# EAGLE design Metal Detector (EAGLE 9.6.2)
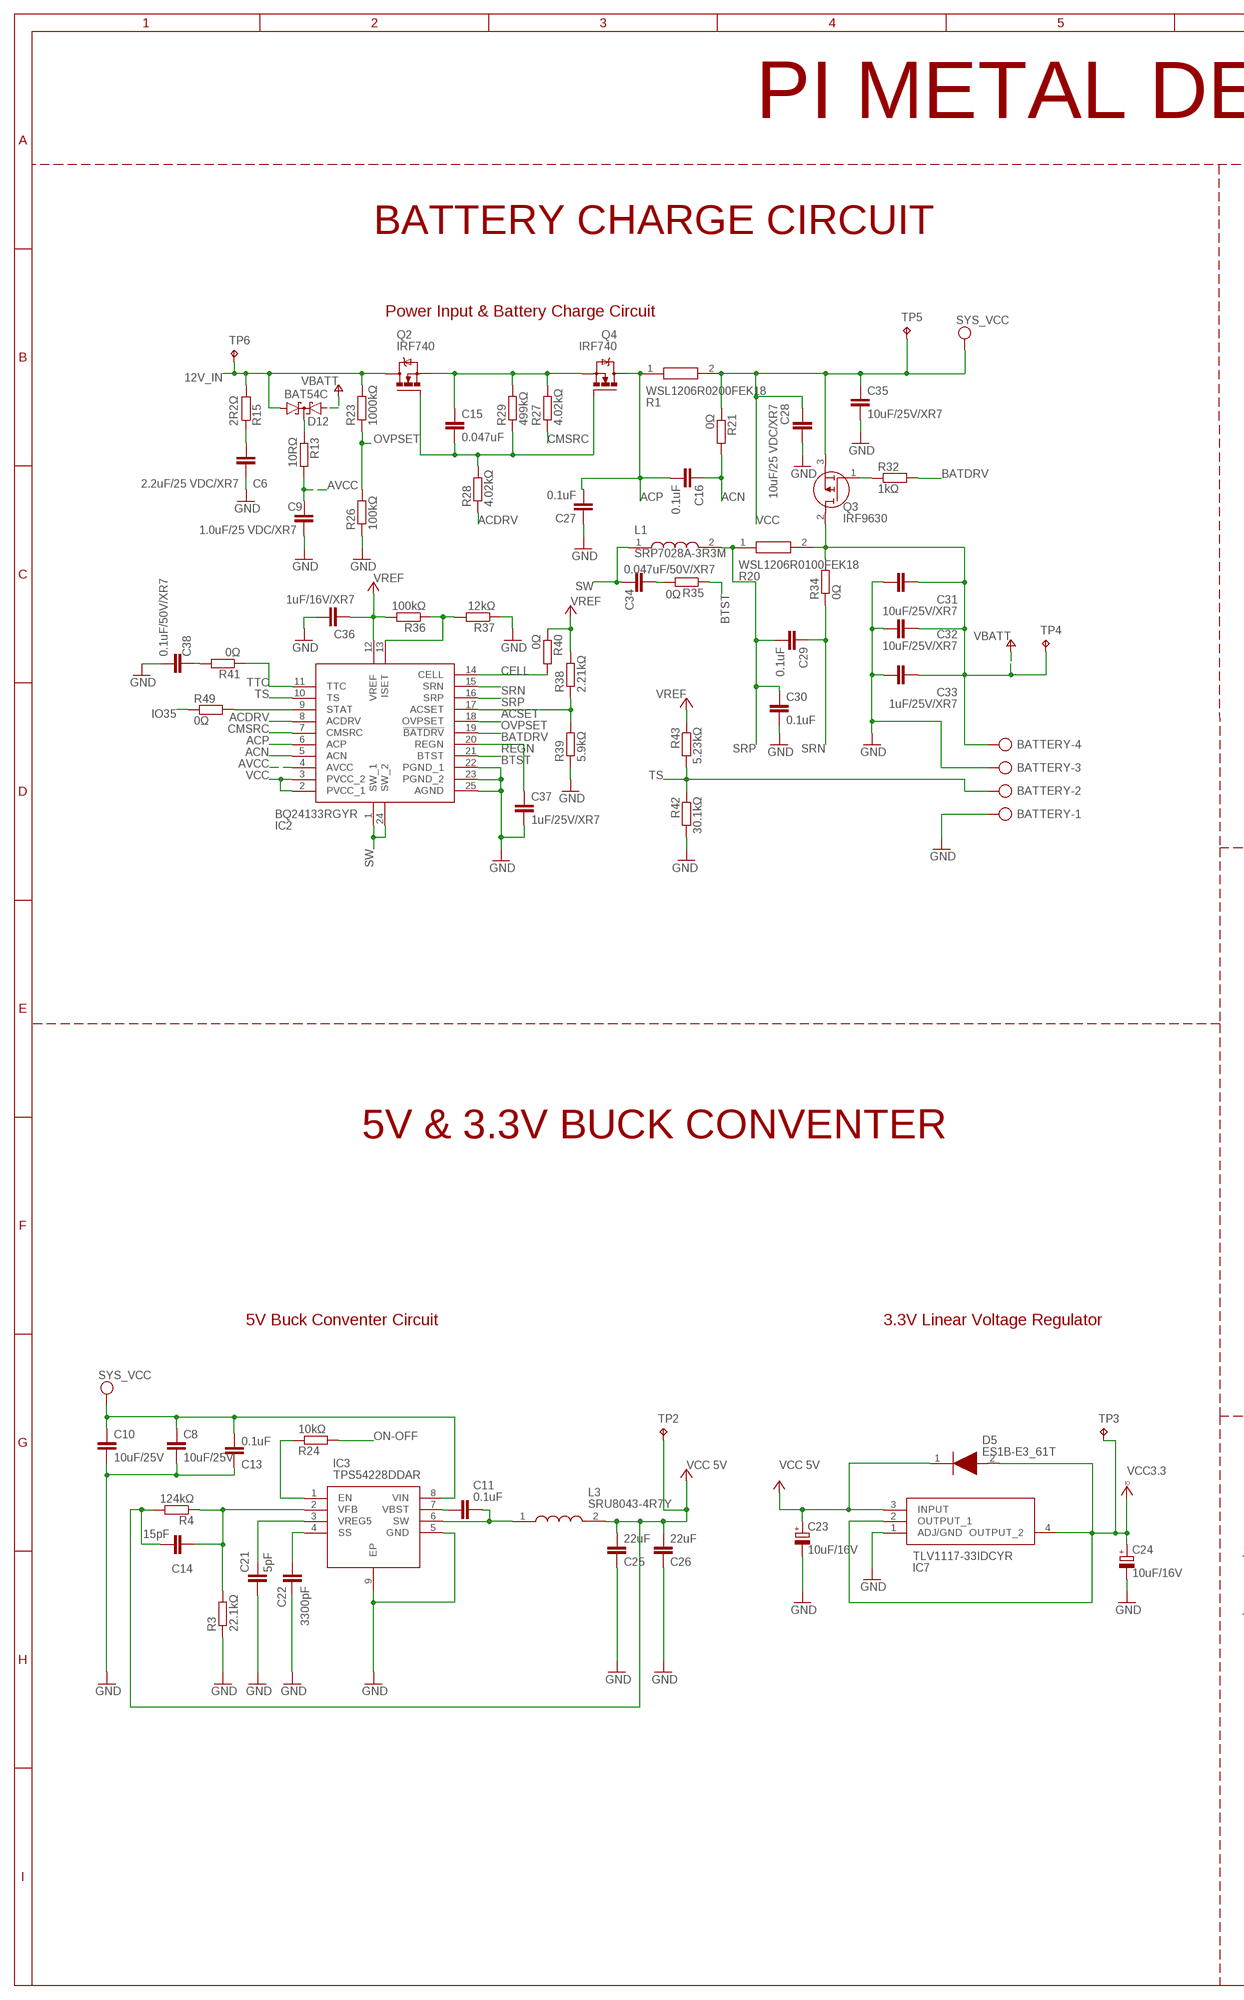
[diagram p0: schematic, sheet 1, part 1 of 2]
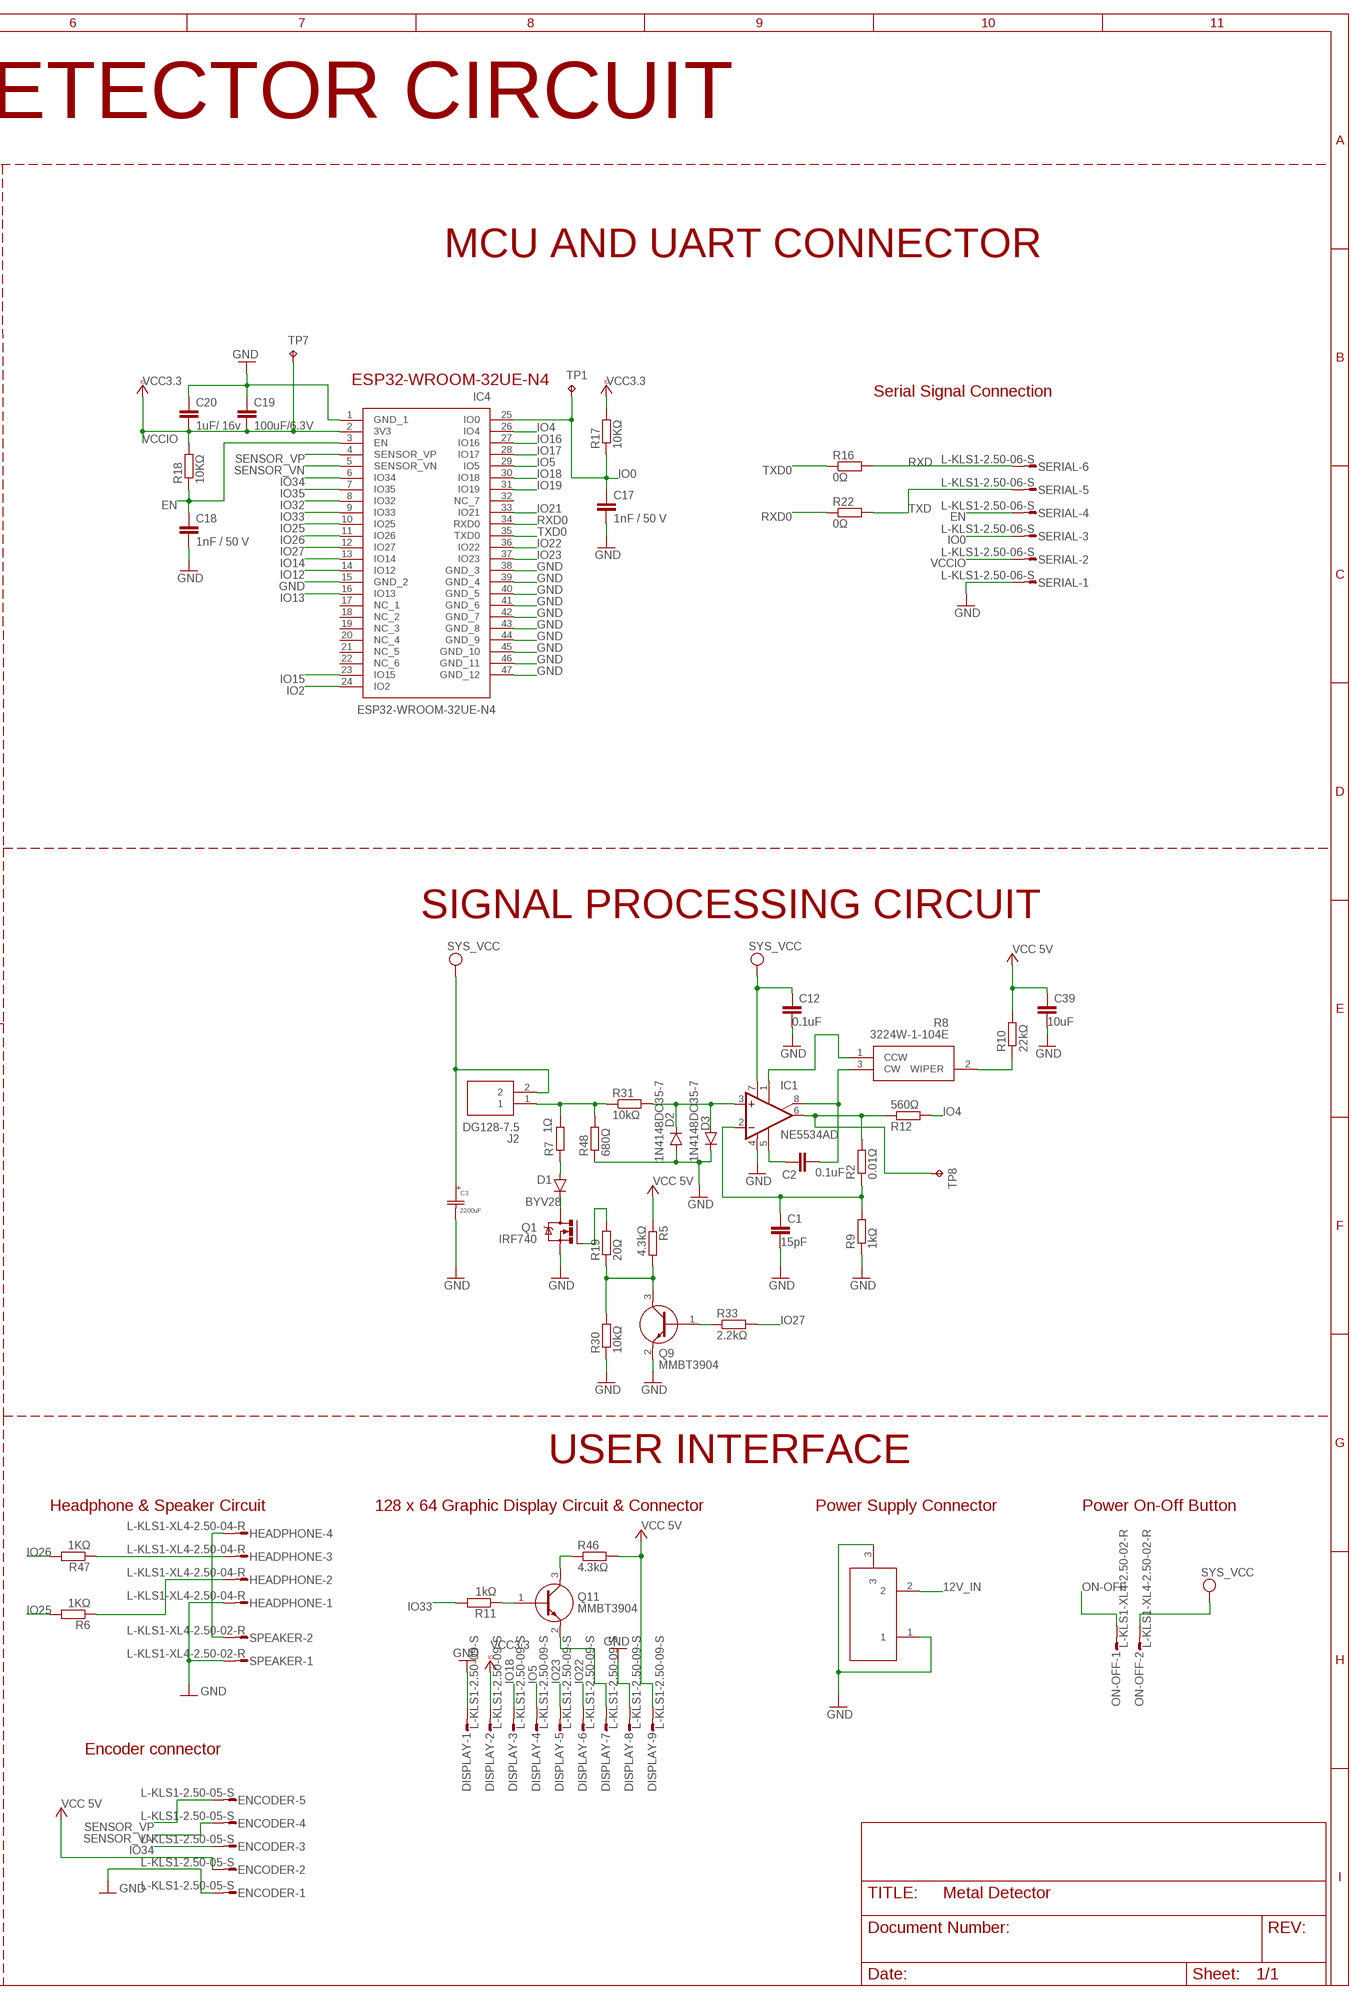
[diagram p1: schematic, sheet 1, part 2 of 2]

## Parts
12VIN  DC21MMX  [DC-21MM]
BATTERY  AK500/4  [AK500/4]
C1  15pF  C-EUC0603  [C0603]
C2  0.1uF  C-EUC0603  [C0603]
C3  2200uF  EEUFR1C222  [CAP_12.5_X_20_PAN]
C6  2.2uF/25 VDC/XR7  1.0UF-1206-50V-10%  [1206]
C8  10uF/25V  C-EUC1210  [C1210]
C9  1.0uF/25 VDC/XR7  1.0UF-1206-50V-10%  [1206]
C10  10uF/25V  C-EUC1210  [C1210]
C11  0.1uF  C-EUC0603  [C0603]
C12  0.1uF  C-EUC0603  [C0603]
C13  0.1uF  C-EUC0603  [C0603]
C14  15pF  C-EUC0603  [C0603]
C15  0.047uF  C-EUC0603  [C0603]
C16  0.1uF  C-EUC0603  [C0603]
C17  1nF / 50 V  C-EUC0603  [C0603]
C18  1nF / 50 V  C-EUC0603  [C0603]
C19  100uF/6.3V  C-EUC1206  [C1206]
C20  1uF/ 16v  C-EUC0603  [C0603]
C21  5pF  C-EUC0603  [C0603]
C22  3300pF  C-EUC0603  [C0603]
C23  10uF/16V  CPOL-EUB  [PANASONIC_B]
C24  10uF/16V  CPOL-EUB  [PANASONIC_B]
C25  22uF  1.0UF-1206-50V-10%  [1206]
C26  22uF  1.0UF-1206-50V-10%  [1206]
C27  0.1uF  C-EUC0603  [C0603]
C28  10uF/25 VDC/XR7  1.0UF-1206-50V-10%  [1206]
C29  0.1uF  C-EUC0603  [C0603]
C30  0.1uF  C-EUC0603  [C0603]
C31  10uF/25V/XR7  1.0UF-1206-50V-10%  [1206]
C32  10uF/25V/XR7  1.0UF-1206-50V-10%  [1206]
C33  1uF/25V/XR7  C-EUC0805  [C0805]
C34  0.047uF/50V/XR7  C-EUC0603  [C0603]
C35  10uF/25V/XR7  1.0UF-1206-50V-10%  [1206]
C36  1uF/16V/XR7  C-EUC0805  [C0805]
C37  1uF/25V/XR7  C-EUC0805  [C0805]
C38  0.1uF/50V/XR7  C-EUC0603  [C0603]
C39  10uF  C-EUC0603  [C0603]
D1  BYV28  [SOD64-10]
D2  1N4148DO35-7  [DO35-7]
D3  1N4148DO35-7  [DO35-7]
D5  ES1B-E3_61T  [DIOM5127X229N]
D12  BAT54C  [SOT23]
DISPLAY  L-KLS1-2.50-09-S  S09P  [S09P]
ENCODER  L-KLS1-2.50-05-S  S05P  [S05P]
HEADPHONE  L-KLS1-XL4-2.50-04-R  S04P  [S04P]
IC1  NE5534AD  [SO08]
IC2  BQ24133RGYR  [BQ24133RGYR]
IC3  TPS54228DDAR  [SOIC127P600X170-9N]
IC4  ESP32-WROOM-32UE-N4  [ESP32WROOM32UEN4]
IC7  TLV1117-33IDCYR  [SOT230P700X180-4N]
J2  DG128-7.5  DG128-7.5-02P-14-00AH  [DG1287502P1400AH]
L1  SRP7028A-3R3M  [SRP7028A3R3M]
L3  SRU8043-4R7Y  SRU8043-330Y  [SRU8043330Y]
ON-OFF  L-KLS1-XL4-2.50-02-R  S02P  [S02P]
Q1  IRF740  [TO220BV]
Q2  IRF740  [TO220BV]
Q3  IRF9630  [TO254P465X1024X2050-3P]
Q4  IRF740  [TO220BV]
Q9  MMBT3904  [SOT95P240X120-3N]
Q11  MMBT3904  [SOT95P240X120-3N]
R1  WSL1206R0200FEK18  WSL1206R0100FEK18  [RESC3216X89N]
R2  0.01Ω  R-EU_R1206  [R1206]
R3  22.1kΩ  R-EU_R0603  [R0603]
R4  124kΩ  R-EU_R0603  [R0603]
R5  4.3kΩ  R-EU_R1206  [R1206]
R6  1KΩ  R-EU_R0603  [R0603]
R7  1Ω  R-EU_0207/10  [0207/10]
R8  3224W-1-104E  [3224W-1-105E]
R9  1kΩ  R-EU_R1206  [R1206]
R10  22kΩ  R-EU_R1206  [R1206]
R11  1kΩ  R-EU_R0603  [R0603]
R12  560Ω  R-EU_R0603  [R0603]
R13  10RΩ  R-EU_R1206  [R1206]
R15  2R2Ω  R-EU_R2010  [R2010]
R16  0Ω  R-EU_R0603  [R0603]
R17  10KΩ  R-EU_R0603  [R0603]
R18  10KΩ  R-EU_R0603  [R0603]
R19  20Ω  R-EU_R1206  [R1206]
R20  WSL1206R0100FEK18  [RESC3216X89N]
R21  0Ω  R-EU_R0603  [R0603]
R22  0Ω  R-EU_R0603  [R0603]
R23  1000kΩ  R-EU_R0603  [R0603]
R24  10kΩ  R-EU_R0603  [R0603]
R26  100kΩ  R-EU_R0603  [R0603]
R27  4.02kΩ  R-EU_R0603  [R0603]
R28  4.02kΩ  R-EU_R0603  [R0603]
R29  499kΩ  R-EU_R0603  [R0603]
R30  10kΩ  R-EU_R1206  [R1206]
R31  10kΩ  R-EU_R1206  [R1206]
R32  1kΩ  R-EU_R0603  [R0603]
R33  2.2kΩ  R-EU_R1206  [R1206]
R34  0Ω  R-EU_R0603  [R0603]
R35  0Ω  R-EU_R0603  [R0603]
R36  100kΩ  R-EU_R0603  [R0603]
R37  12kΩ  R-EU_R0603  [R0603]
R38  2.21kΩ  R-EU_R0603  [R0603]
R39  5.9kΩ  R-EU_R0603  [R0603]
R40  0Ω  R-EU_R0603  [R0603]
R41  0Ω  R-EU_R0603  [R0603]
R42  30.1kΩ  R-EU_R0603  [R0603]
R43  5.23kΩ  R-EU_R0603  [R0603]
R46  4.3kΩ  R-EU_R1206  [R1206]
R47  1KΩ  R-EU_R0603  [R0603]
R48  680Ω  R-EU_R1206  [R1206]
R49  0Ω  R-EU_R0603  [R0603]
SERIAL  L-KLS1-2.50-06-S  S06P  [S06P]
SPEAKER  L-KLS1-XL4-2.50-02-R  S02P  [S02P]
TP1  TPTP10R  [TP10R]
TP2  TPTP10R  [TP10R]
TP3  TPTP10R  [TP10R]
TP4  TPTP10R  [TP10R]
TP5  TPTP10R  [TP10R]
TP6  TPTP10R  [TP10R]
TP7  TPTP10R  [TP10R]
TP8  TPTP10R  [TP10R]

## Nets
12V_IN: 12VIN.2 D12.1(A1) Q2.D R15.2 R23.2 TP6.TP
ACDRV: IC2.8(ACDRV) R28.1
ACN: C16.1 IC2.5(ACN) R21.2
ACP: C16.2 C27.2 IC2.6(ACP) Q4.D R1.1
ACSET: IC2.17(ACSET) R38.1 R39.2
AVCC: C9.1 IC2.4(AVCC) R13.2
BATDRV: IC2.19(!BATDRV) R32.2
BTST: IC2.21(BTST) R35.1
CELL: IC2.14(CELL) R40.2
CMSRC: IC2.7(CMSRC) R27.1
EN: C18.1 IC4.3(EN) R18.1 SERIAL.4
GND: 12VIN.1 12VIN.3 BATTERY.1 BATTERY.3 C1.2 C3.2 C6.2 C8.2 C9.2 C10.2 C12.2 C13.2 C17.2 C18.2 C19.1 C20.1 C21.2 C22.2 C23.- C24.- C25.2 C26.2 C27.1 C28.2 C30.2 C31.2 C32.2 C33.2 C35.2 C36.1 C37.2 C38.2 C39.2 D2.A D3.C DISPLAY.1 DISPLAY.8 ENCODER.1 HEADPHONE.1 IC1.4(V-) IC2.22(PGND_1) IC2.23(PGND_2) IC2.25(AGND) IC3.5(GND) IC3.9(EP) IC4.1(GND_1) IC4.15(GND_2) IC4.38(GND_3) IC4.39(GND_4) IC4.40(GND_5) IC4.41(GND_6) IC4.42(GND_7) IC4.43(GND_8) IC4.44(GND_9) IC4.45(GND_10) IC4.46(GND_11) IC4.47(GND_12) IC7.1(ADJ/GND) Q1.S Q9.2(E) R3.1 R9.1 R26.1 R30.1 R37.1 R39.1 R42.2 R48.1 SERIAL.1 SPEAKER.1
IO0: C17.1 IC4.25(IO0) R17.1 SERIAL.3 TP1.TP
IO2: IC4.24(IO2)
IO4: IC1.6(OUT) IC4.26(IO4) R2.2 R12.1 R12.2 TP8.TP
IO5: DISPLAY.4 IC4.29(IO5)
IO12: IC4.14(IO12)
IO13: IC4.16(IO13)
IO14: IC4.13(IO14)
IO15: IC4.23(IO15)
IO16: IC4.27(IO16)
IO17: IC4.28(IO17)
IO18: DISPLAY.3 IC4.30(IO18)
IO19: IC4.31(IO19)
IO21: IC4.33(IO21)
IO22: DISPLAY.6 IC4.36(IO22)
IO23: DISPLAY.5 IC4.37(IO23)
IO25: IC4.10(IO25) R6.2
IO26: IC4.11(IO26) R47.2
IO27: IC4.12(IO27) R33.2
IO32: IC4.8(IO32)
IO33: IC4.9(IO33) R11.2
IO34: ENCODER.3 IC4.6(IO34)
IO35: IC2.9(STAT) IC4.7(IO35) R49.1 R49.2
ISET: IC2.13(ISET) R36.1 R37.2
N$1: D2.C D3.A IC1.3(+IN) R31.2
N$2: Q1.G R19.2
N$3: Q9.3(C) R5.2 R19.1 R30.2
N$4: D1.A R7.1
N$5: Q9.1(B) R33.1
N$6: D1.C Q1.D
N$7: J2.1 R7.2 R31.1 R48.2
N$8: HEADPHONE.2 R6.1
N$9: IC1.1(ON) R8.1(CCW)
N$10: R8.2(WIPER) R10.1
N$11: C2.2 IC1.8(ON/CMP) R8.3(CW)
N$12: C1.1 IC1.2(-IN) R2.1 R9.2
N$13: C2.1 IC1.5(CMP)
N$14: D12.3(CC) R13.1
N$15: DISPLAY.7 Q11.2(E)
N$16: C6.1 R15.1
N$17: IC3.1(EN) R24.1
N$18: C11.1 IC3.7(VBST)
N$19: C11.2 IC3.6(SW) L3.1
N$21: C15.1 Q2.S Q4.S R27.2 R29.2
N$22: C15.2 Q2.G Q4.G R28.2 R29.1
N$23: Q3.1(G) R32.1
N$24: C14.1 IC3.2(VFB) R3.2 R4.1
N$25: C34.2 R35.2
N$27: C38.1 R41.2
N$29: HEADPHONE.4 SPEAKER.2
N$30: C21.1 IC3.3(VREG5)
N$31: Q11.1(B) R11.1
N$32: HEADPHONE.3 R47.1
N$33: C22.1 IC3.4(SS)
N$35: Q11.3(C) R46.1
ON-OFF: ON-OFF.1 R24.2
OVPSET: IC2.18(OVPSET) R23.1 R26.2
REGN: C37.1 IC2.20(REGN)
RXD: R16.2 SERIAL.6
RXD0: IC4.34(RXD0) R22.1
SENSOR_VN: ENCODER.4 IC4.5(SENSOR_VN)
SENSOR_VP: ENCODER.5 IC4.4(SENSOR_VP)
SRN: C29.1 IC2.15(SRN) R34.1
SRP: C29.2 C30.1 IC2.16(SRP) L1.2 R20.1
SW: C34.1 IC2.1(SW_1) IC2.24(SW_2) L1.1
TS: BATTERY.2 IC2.10(TS) R42.1 R43.2
TTC: IC2.11(TTC) R41.1
TXD: R22.2 SERIAL.5
TXD0: IC4.35(TXD0) R16.1
VBATT: BATTERY.4 C31.1 C32.1 C33.1 D12.2(A2) Q3.2(D) R20.2 R34.2 TP4.TP
VCC: C3.1 C8.1 C10.1 C12.1 C13.1 C14.2 C23.+ C25.1 C26.1 C28.1 C35.1 C36.2 C39.1 D5.1(K) DISPLAY.9 ENCODER.2 IC1.7(V+) IC2.2(PVCC_1) IC2.3(PVCC_2) IC2.12(VREF) IC3.8(VIN) IC7.3(INPUT) J2.2 L3.2 ON-OFF.2 Q3.3(S) R1.2 R4.2 R5.1 R10.2 R21.1 R36.2 R38.2 R40.1 R43.1 R46.2 TP2.TP TP5.TP ; supply symbol labelled VREF, VCC 5V, SYS_VCC
VCCIO: C19.2 C20.2 C24.+ D5.2(A) DISPLAY.2 IC4.2(3V3) IC7.2(OUTPUT_1) IC7.4(OUTPUT_2) R17.2 R18.2 SERIAL.2 TP3.TP TP7.TP ; supply symbol labelled VCC3.3
Unconnected: IC4.17(NC_1) IC4.18(NC_2) IC4.19(NC_3) IC4.20(NC_4) IC4.21(NC_5) IC4.22(NC_6) IC4.32(NC_7)

## Notes on the sheet
- PI METAL DETECTOR CIRCUIT
- BATTERY CHARGE CIRCUIT
- MCU AND UART CONNECTOR
- Power Input & Battery Charge Circuit
- ESP32-WROOM-32UE-N4
- Serial Signal Connection
- SIGNAL PROCESSING CIRCUIT
- 5V & 3.3V BUCK CONVENTER
- 5V Buck Conventer Circuit | 3.3V Linear Voltage Regulator
- USER INTERFACE
- Headphone & Speaker Circuit | 128 x 64 Graphic Display Circuit & Connector | Power Supply Connector | Power On-Off Button
- Encoder connector

## Library data of the parts
12VIN = powersupply:DC21MM
BATTERY = con-ptr500:AK500/4: CONNECTOR; OC_FARNELL: unknown; OC_NEWARK: unknown
C1 C2 C8 C10-C22 C27 C29 C30 C33 C34 C36-C39 = rcl:C-EU: CAPACITOR, European symbol; SPICEPREFIX: C
C3 = 2200uF capacitor:EEUFR1C222; COPYRIGHT: Copyright (C) 2024 Ultra Librarian. All rights reserved.; MANUFACTURER_PART_NUMBER: EEUFR1C222; MFR_NAME: Panasonic
C6 C9 C25 C26 C28 C31 C32 C35 = SparkFun-Capacitors:1.0UF: 1µF ceramic capacitors A capacitor is a passive two-terminal electrical component used to store electrical energy temporarily in an electric field.; PROD_ID: CAP-09822; VALUE: 1.0uF
C23 C24 = rcl:CPOL-EU: POLARIZED CAPACITOR, European symbol; SPICEPREFIX: C
D1 = diode:BYV28: DIODE ultra fast
D2 D3 = diode:1N4148: DIODE high speed (Philips)
D5 = ES1B-E3_61T:ES1B-E3_61T: Vishay ES1B-E3/61T SMT Switching Diode, 100V 1A, 2-Pin DO-214AC Source: Datasheet <https://www.vishay.com/docs/88586/es1.pdf>; ARROW_PART_NUMBER: ES1B-E3/61T; ARROW_PRICE-STOCK: https://www.arrow.com/en/products/es1b-e361t/vishay?region=nac; DESCRIPTION: Vishay ES1B-E3/61T SMT Switching Diode, 100V 1A, 2-Pin DO-214AC; HEIGHT: 2.29mm; MANUFACTURER_NAME: Vishay; MANUFACTURER_PART_NUMBER: ES1B-E3/61T; MOUSER_PART_NUMBER: 625-ES1B-E3; MOUSER_PRICE-STOCK: https://www.mouser.co.uk/ProductDetail/Vishay-General-Semiconductor/ES1B-E3-61T?qs=rfh7uIuiIO30EPNqOSFFMQ%3D%3D
D12 = diode:BAT54C: Schottky Diodes Source: Fairchild .. BAT54.pdf
DISPLAY = con-amp-mt:S09P: AMP MT CONNECTOR; OC_FARNELL: unknown; OC_NEWARK: unknown
ENCODER = con-amp-mt:S05P: AMP MT CONNECTOR; OC_FARNELL: unknown; OC_NEWARK: unknown
HEADPHONE = con-amp-mt:S04P: AMP MT CONNECTOR; OC_FARNELL: unknown; OC_NEWARK: unknown
IC1 = linear:NE5534: LOW-NOISE OPERATIONAL AMPLIFIER Source: http://focus.ti.com/lit/ds/symlink/ne5534.pdf
IC2 = BQ24133RGYR:BQ24133RGYR: Synchronous Switch-Mode Li-Ion and Li-Polymer Stand-Alone Battery Charger Source: Datasheet <http://www.ti.com/lit/gpn/BQ24133>; ARROW_PART_NUMBER: BQ24133RGYR; ARROW_PRICE-STOCK: https://www.arrow.com/en/products/bq24133rgyr/texas-instruments?region=nac; DESCRIPTION: Synchronous Switch-Mode Li-Ion and Li-Polymer Stand-Alone Battery Charger; HEIGHT: 1mm; MANUFACTURER_NAME: Texas Instruments; MANUFACTURER_PART_NUMBER: BQ24133RGYR; MOUSER_PART_NUMBER: 595-BQ24133RGYR; MOUSER_PRICE-STOCK: https://www.mouser.co.uk/ProductDetail/Texas-Instruments/BQ24133RGYR?qs=O1HRStiETChtddIVJFsUHw%3D%3D
IC3 = TPS54228DDAR:TPS54228DDAR: 4.5V to 18V Input, 2-A Synchronous Step-Down Converter with Eco-mode™ Source: Datasheet <http://www.ti.com/lit/gpn/tps54228>; ARROW_PART_NUMBER: TPS54228DDAR; ARROW_PRICE-STOCK: https://www.arrow.com/en/products/tps54228ddar/texas-instruments?region=nac; DESCRIPTION: 4.5V to 18V Input, 2-A Synchronous Step-Down Converter with Eco-mode&#153;; HEIGHT: 1.7mm; MANUFACTURER_NAME: Texas Instruments; MANUFACTURER_PART_NUMBER: TPS54228DDAR; MOUSER_PART_NUMBER: 595-TPS54228DDAR; MOUSER_PRICE-STOCK: https://www.mouser.co.uk/ProductDetail/Texas-Instruments/TPS54228DDAR?qs=L4ss%2FyqpMWRs7St6kwWLyQ%3D%3D
IC4 = ESP32-WROOM-32UE-N4:ESP32-WROOM-32UE-N4: WiFi Modules - 802.11 SMD module ESP32-WROOM-32UE, ESP32-D0WD-V3, ESP32 ECO V3, 4 MB SPI flash, IPEX antenna connector Source: Datasheet <https://www.espressif.com/sites/default/files/documentation/esp32-wroom-32e_esp32-wroom-32ue_datasheet_en.pdf>; DESCRIPTION: WiFi Modules - 802.11 SMD module ESP32-WROOM-32UE, ESP32-D0WD-V3, ESP32 ECO V3, 4 MB SPI flash, IPEX antenna connector; HEIGHT: 3.35mm; MANUFACTURER_NAME: Espressif Systems; MANUFACTURER_PART_NUMBER: ESP32-WROOM-32UE-N4; MOUSER_PART_NUMBER: 356-ESP32WRM32UE32UH; MOUSER_PRICE-STOCK: https://www.mouser.co.uk/ProductDetail/Espressif-Systems/ESP32-WROOM-32UE-N4?qs=Li%252BoUPsLEnsnnWrvUBU2ZA%3D%3D
IC7 = TLV1117-33IDCYR:TLV1117-33IDCYR: Single Output LDO, 800mA, Fixed and Adj., Internal Current limit, Thermal Overload Protection Source: Datasheet <https://datasheet.datasheetarchive.com/originals/distributors/Datasheets-DGA25/1767134.pdf>; ARROW_PART_NUMBER: TLV1117-33IDCYR; ARROW_PRICE-STOCK: https://www.arrow.com/en/products/tlv1117-33idcyr/texas-instruments?region=nac; DESCRIPTION: Single Output LDO, 800mA, Fixed and Adj., Internal Current limit, Thermal Overload Protection; HEIGHT: 1.8mm; MANUFACTURER_NAME: Texas Instruments; MANUFACTURER_PART_NUMBER: TLV1117-33IDCYR; MOUSER_PART_NUMBER: 595-TLV1117-33IDCYR; MOUSER_PRICE-STOCK: https://www.mouser.co.uk/ProductDetail/Texas-Instruments/TLV1117-33IDCYR?qs=p6lVfQR1GSoKgp3tAXcW5w%3D%3D
J2 = DG128-7.5-02P-14-00AH:DG128-7.5-02P-14-00AH: Terminal Block 450V 2-Pole Green Source: Datasheet; DESCRIPTION: Terminal Block 450V 2-Pole Green; HEIGHT: 14mm; MANUFACTURER_NAME: Degson; MANUFACTURER_PART_NUMBER: DG128-7.5-02P-14-00AH
L1 = SRP7028A-3R3M:SRP7028A-3R3M: Bourns SRP7028A Series Type 7028 Shielded Wire-wound SMD Inductor with a Carbonyl Powder Core, 3.3 uH +/-20% Wire-Wound Source: Datasheet <https://www.bourns.com/docs/Product-Datasheets/SRP7028A.pdf>; ARROW_PART_NUMBER: SRP7028A-3R3M; ARROW_PRICE-STOCK: https://www.arrow.com/en/products/srp7028a-3r3m/bourns; DESCRIPTION: Bourns SRP7028A Series Type 7028 Shielded Wire-wound SMD Inductor with a Carbonyl Powder Core, 3.3 uH +/-20% Wire-Wound; HEIGHT: 3mm; MANUFACTURER_NAME: Bourns; MANUFACTURER_PART_NUMBER: SRP7028A-3R3M; MOUSER_PART_NUMBER: 652-SRP7028A-3R3M; MOUSER_PRICE-STOCK: https://www.mouser.co.uk/ProductDetail/Bourns/SRP7028A-3R3M?qs=7z%252BmIopC6%2FLTitLWxClV8Q%3D%3D
L3 = SRU8043-330Y:SRU8043-330Y: 33 H Shielded Drum Core, Wirewound Inductor 1.7 A 100mOhm Nonstandard Source: Datasheet <https://www.bourns.com/docs/product-datasheets/sru8043.pdf>; ARROW_PART_NUMBER: SRU8043-330Y; ARROW_PRICE-STOCK: https://www.arrow.com/en/products/sru8043-330y/bourns?region=europe; DESCRIPTION: 33 H Shielded Drum Core, Wirewound Inductor 1.7 A 100mOhm Nonstandard; HEIGHT: 4.6mm; MANUFACTURER_NAME: Bourns; MANUFACTURER_PART_NUMBER: SRU8043-330Y; MOUSER_PART_NUMBER: 652-SRU8043-330Y; MOUSER_PRICE-STOCK: https://www.mouser.co.uk/ProductDetail/Bourns/SRU8043-330Y?qs=3fQS%252B%2FKBkgz%2FMxFC%2FAjkIg%3D%3D
ON-OFF SPEAKER = con-amp-mt:S02P: AMP MT CONNECTOR; OC_FARNELL: unknown; OC_NEWARK: unknown
Q1 Q2 Q4 = IRF740:IRF740: N-CHANNEL MOS FET Check availability <https://pricing.snapeda.com/parts/IRF740/Vishay/view-part?ref=eda>; AVAILABILITY: In Stock; CHECK_PRICES: https://www.snapeda.com/parts/IRF740/Vishay+Siliconix/view-part/?ref=eda; DESCRIPTION: N-Channel 400 V 10A (Tc) 3.1W (Ta), 125W (Tc) Surface Mount D²PAK (TO-263); MF: Vishay; MP: IRF740; PACKAGE: TO-220-3 Vishay; PRICE: None; PURCHASE-URL: https://www.snapeda.com/api/url_track_click_mouser/?unipart_id=552701&manufacturer=Vishay&part_name=IRF740&search_term=None; SNAPEDA_LINK: https://www.snapeda.com/parts/IRF740/Vishay+Siliconix/view-part/?ref=snap
Q3 = IRF9630:IRF9630: Trans MOSFET P-CH 200V 6.5A 3-Pin(3+Tab) TO-220AB - Bulk Source: Datasheet <https://componentsearchengine.com/Datasheets/1/IRF9630.pdf>; DESCRIPTION: Trans MOSFET P-CH 200V 6.5A 3-Pin(3+Tab) TO-220AB - Bulk; HEIGHT: 4.65mm; MANUFACTURER_NAME: Vishay; MANUFACTURER_PART_NUMBER: IRF9630; MOUSER_PART_NUMBER: 844-IRF9630; MOUSER_PRICE-STOCK: https://www.mouser.co.uk/ProductDetail/Vishay-Siliconix/IRF9630?qs=ehM%252BESVsXgyTXowvYem%2FGA%3D%3D
Q9 Q11 = MMBT3904:MMBT3904: Transistor GP BJT NPN 40V 0.2A SOT23 Fairchild MMBT3904 NPN Bipolar Transistor, 0.2 A, 40 V, 3-Pin SOT-23 Source: Datasheet <https://media.digikey.com/pdf/Data Sheets/ON Semiconductor PDFs/2N3904,MMBT3904,PZT3904.pdf>; ARROW_PART_NUMBER: MMBT3904; ARROW_PRICE-STOCK: https://www.arrow.com/en/products/mmbt3904/on-semiconductor; DESCRIPTION: Transistor GP BJT NPN 40V 0.2A SOT23 Fairchild MMBT3904 NPN Bipolar Transistor, 0.2 A, 40 V, 3-Pin SOT-23; HEIGHT: 1.2mm; MANUFACTURER_NAME: onsemi; MANUFACTURER_PART_NUMBER: MMBT3904; MOUSER_PART_NUMBER: 512-MMBT3904; MOUSER_PRICE-STOCK: https://www.mouser.co.uk/ProductDetail/onsemi-Fairchild/MMBT3904?qs=UMEuL5FsraCg3xKjS4uBJQ%3D%3D
R1 R20 = WSL1206R0100FEK18:WSL1206R0100FEK18: Res Metal Strip 1206 0.01 Ohm 1% 0.5W(1/2W) +/-75ppm/C Molded SMD Bulk Source: Datasheet <https://www.arrow.com/en/products/wsl1206r0100fek18/vishay>; ARROW_PART_NUMBER: WSL1206R0100FEK18; ARROW_PRICE-STOCK: https://www.arrow.com/en/products/wsl1206r0100fek18/vishay; DESCRIPTION: Res Metal Strip 1206 0.01 Ohm 1% 0.5W(1/2W) +/-75ppm/C Molded SMD Bulk; HEIGHT: 0.889mm; MANUFACTURER_NAME: Vishay; MANUFACTURER_PART_NUMBER: WSL1206R0100FEK18; MOUSER_PART_NUMBER: 71-WSL1206R0100FEK18; MOUSER_PRICE-STOCK: https://www.mouser.co.uk/ProductDetail/Vishay-Dale/WSL1206R0100FEK18?qs=chgxS0gduQ54D2t1c1PRvA%3D%3D
R2-R7 R9-R13 R15-R19 R21-R24 R26-R43 R46-R49 = rcl:R-EU_: RESISTOR, European symbol; SPICEPREFIX: R
R8 = 3224W-1-104E:3224W-1-104E: 3224W SMT topadj cermet trimmer,100K 4mm Bourns 3224W Series 12-Turn SMD Cermet Trimmer Resistor with J-Hook Terminations, 100k +/-10% 0.25W +/-100ppm/C Top Adjust Source: Datasheet <https://componentsearchengine.com/Datasheets/1/3224W-1-104E.pdf>; ARROW_PART_NUMBER: 3224W-1-104E; ARROW_PRICE-STOCK: https://www.arrow.com/en/products/3224w-1-104e/bourns?region=europe; DESCRIPTION: 3224W SMT topadj cermet trimmer,100K 4mm Bourns 3224W Series 12-Turn SMD Cermet Trimmer Resistor with J-Hook Terminations, 100k +/-10% 0.25W +/-100ppm/C Top Adjust; HEIGHT: mm; MANUFACTURER_NAME: Bourns; MANUFACTURER_PART_NUMBER: 3224W-1-104E; MOUSER_PART_NUMBER: 652-3224W-1-104E; MOUSER_PRICE-STOCK: https://www.mouser.co.uk/ProductDetail/Bourns/3224W-1-104E?qs=tEaODSGlU8OdLSz6q8wtag%3D%3D
SERIAL = con-amp-mt:S06P: AMP MT CONNECTOR; OC_FARNELL: unknown; OC_NEWARK: unknown
TP1-TP8 = testpad:TP: Test pad

## Module 12VINPUTANDCHARGER
Ports: 

### Library data of the parts

## Net classes
0 default: clearance 0.205 mm

## Board
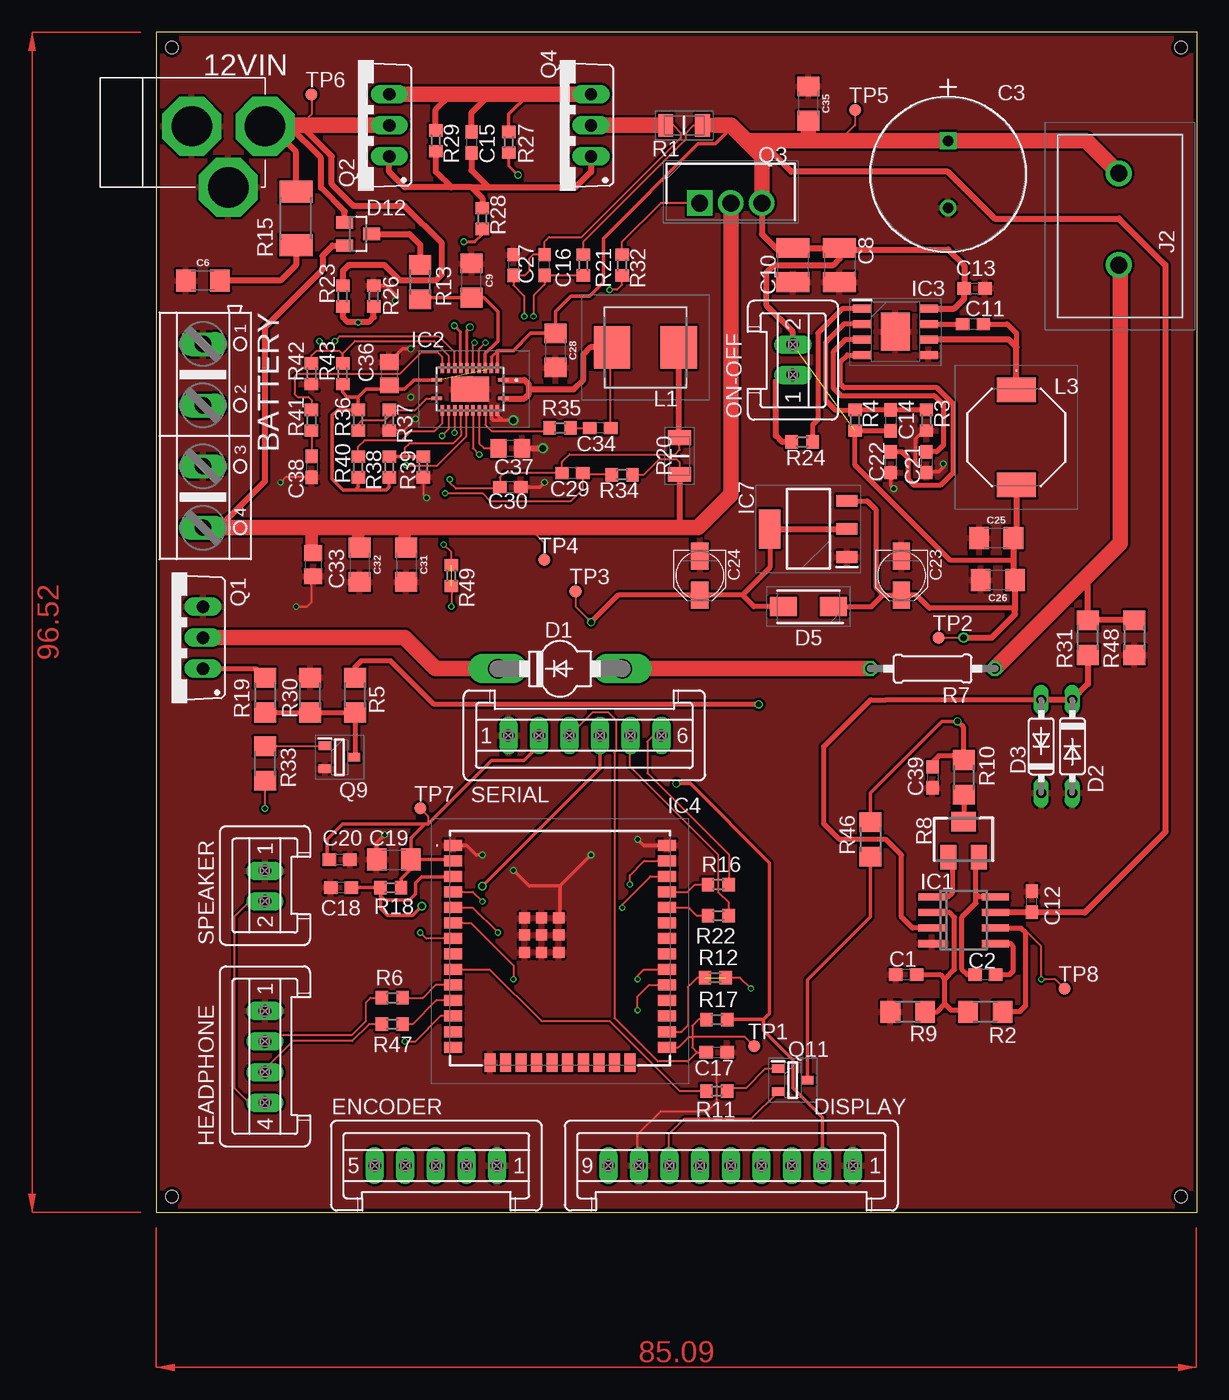
[diagram p2: board, top side]
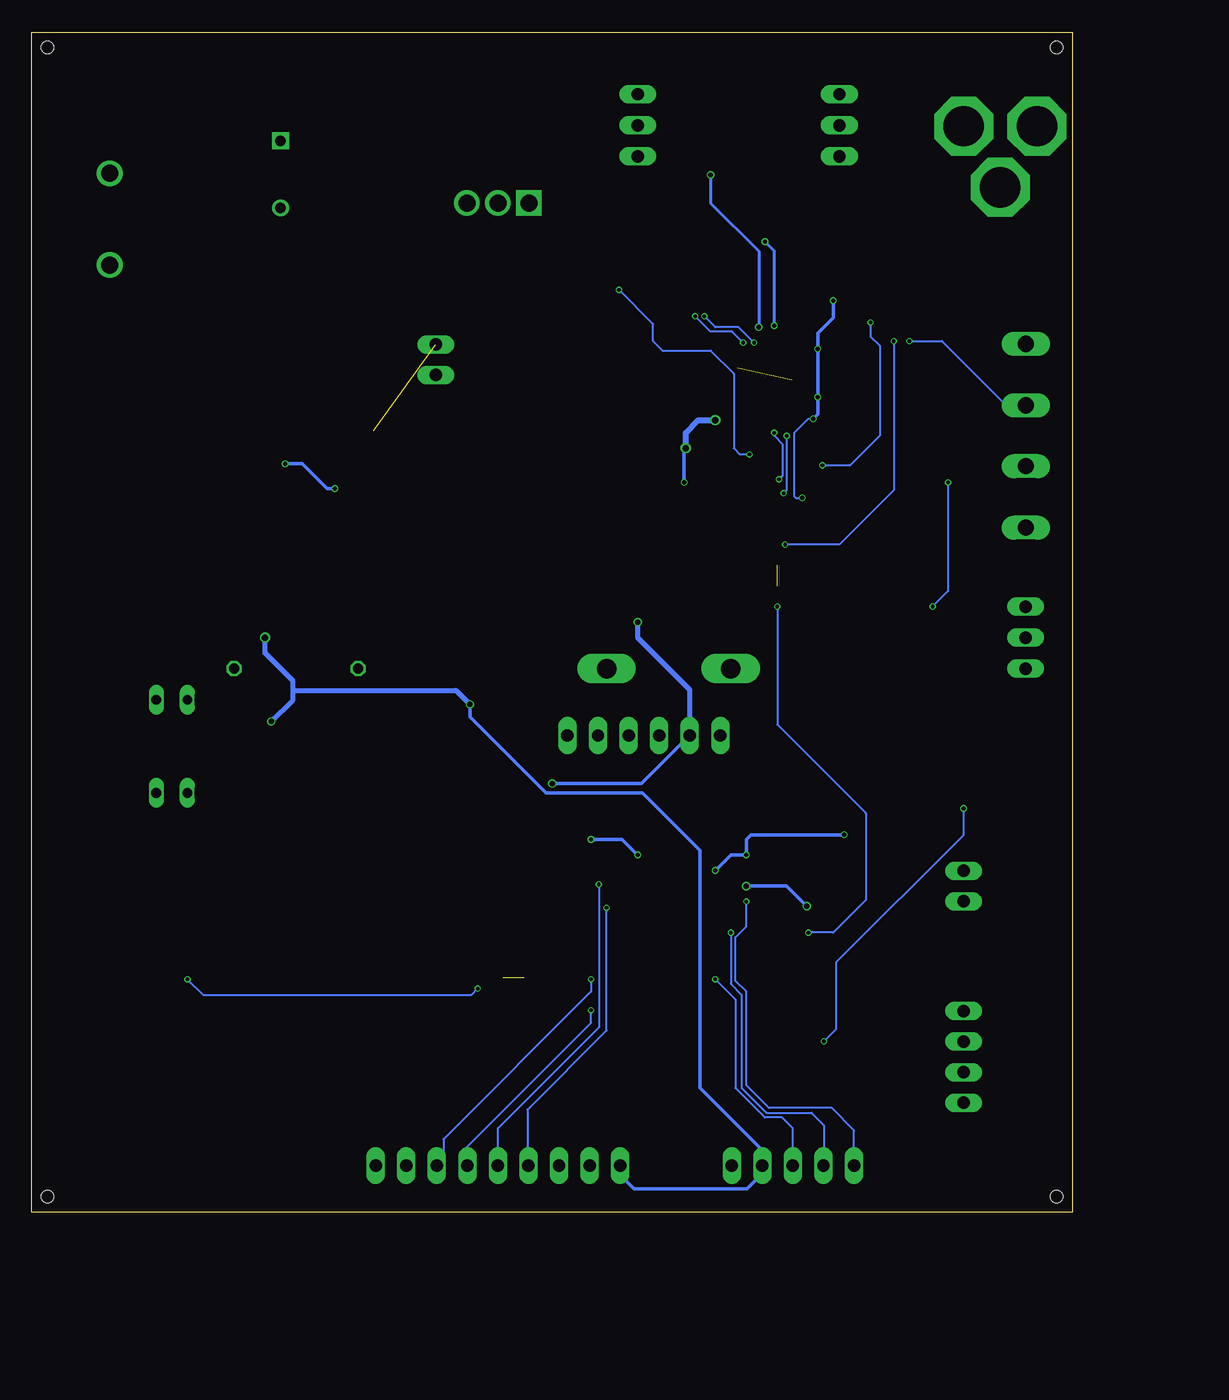
[diagram p3: board, bottom side, seen from below]

Size 85.14 x 96.51 mm. Coordinates in mm from the lower left corner, seen from the top.
Outline: 0,0 85.14,0 85.14,96.51 0,96.51 0,0
Copper layers (1*16): Top 0.0696mm / dielectric 1.5mm / Bottom 0.0696mm
Design rules "PCBWay_2L_152um-Track *": minimum track width 6mil, minimum drill 0.3mm, track to track 6mil, track to pad 6mil, pad to pad 6mil, via to via 6mil, smd to smd 0mil, copper to edge 0.3mm, drill to drill 10mil, minimum pad ring 6mil, minimum via ring 0.1mm, stop-mask expansion 2mil, vias tented up to drill 0.45mm, thermal gap 0.2mm
Holes 1 mm at 1.27,95.25 83.82,95.25 83.82,1.27 1.27,1.27

### Footprints (pad centres in the part's own frame; a part is rotated, then mirrored left to right if it is on the bottom)
DC-21MM = drill 3.302 pad 4.826 octagon: 1 -5.08,-3.353; 2 -0.076,-6.35; 3 -0.076,-0.356
AK500/4 = drill 1.321 long: 1 -7.518,0; 2 -2.489,0; 3 2.489,0; 4 7.518,0
C0603 = smd 1.1 x 1: 1 -0.85,0; 2 0.85,0
CAP_12.5_X_20_PAN = drill 0.864 pad 1.372 square: 1 0,0 | drill 0.864 pad 1.372: 2 5.486,0
1206 = smd 1.6 x 1.8: 1 -1.4,0; 2 1.4,0
C1210 = smd 1.6 x 2.7: 1 -1.4,0; 2 1.4,0
C1206 = smd 1.6 x 1.8: 1 -1.4,0; 2 1.4,0
PANASONIC_B = smd 2.2 x 1.4: + 1.6,0; - -1.6,0
C0805 = smd 1.3 x 1.5: 1 -0.95,0; 2 0.95,0
SOD64-10 = drill 1.6 long: A 5.08,0; C -5.08,0
DO35-7 = drill 0.813 long: A 3.81,0; C -3.81,0
DIOM5127X229N = smd 2.2 x 1.55: 1 -2.05,0; 2 2.05,0
SOT23 = smd 1 x 1.4: 1 -0.95,-1.1; 2 0.95,-1.1; 3 0,1.1
S09P = drill 1.016 long: 1 10,0; 2 7.5,0; 3 5,0; 4 2.5,0; 5 0,0; 6 -2.5,0; 7 -5,0; 8 -7.5,0; 9 -10,0
S05P = drill 1.016 long: 1 5,0; 2 2.5,0; 3 0,0; 4 -2.5,0; 5 -5,0
S04P = drill 1.016 long: 1 3.75,0; 2 1.25,0; 3 -1.25,0; 4 -3.75,0
SO08 = smd 0.6 x 2.2: 1 -1.905,-2.6; 2 -0.635,-2.6; 3 0.635,-2.6; 4 1.905,-2.6; 5 1.905,2.6; 6 0.635,2.6; 7 -0.635,2.6; 8 -1.905,2.6
BQ24133RGYR = smd 0.85 x 0.28: 1 -2.725,-0.75; 12 2.725,-0.75; 13 2.725,0.75; 24 -2.725,0.75 | smd 0.28 x 0.85: 2 -2.25,-1.725; 3 -1.75,-1.725; 4 -1.25,-1.725; 5 -0.75,-1.725; 6 -0.25,-1.725; 7 0.25,-1.725; 8 0.75,-1.725; 9 1.25,-1.725; 10 1.75,-1.725; 11 2.25,-1.725; 14 2.25,1.725; 15 1.75,1.725; 16 1.25,1.725; 17 0.75,1.725; 18 0.25,1.725; 19 -0.25,1.725; 20 -0.75,1.725; 21 -1.25,1.725; 22 -1.75,1.725; 23 -2.25,1.725 | smd 3.1 x 2.05: 25 0,0
SOIC127P600X170-9N = smd 1.525 x 0.65: 1 -2.712,1.905; 2 -2.712,0.635; 3 -2.712,-0.635; 4 -2.712,-1.905; 5 2.712,-1.905; 6 2.712,-0.635; 7 2.712,0.635; 8 2.712,1.905 | smd 2.4 x 3.1: 9 0,0
ESP32WROOM32UEN4 = smd 1.5 x 0.9: 1 -8.75,8.41; 2 -8.75,7.14; 3 -8.75,5.87; 4 -8.75,4.6; 5 -8.75,3.33; 6 -8.75,2.06; 7 -8.75,0.79; 8 -8.75,-0.48; 9 -8.75,-1.75; 10 -8.75,-3.02; 11 -8.75,-4.29; 12 -8.75,-5.56; 13 -8.75,-6.83; 14 -8.75,-8.1; 25 8.75,-8.1; 26 8.75,-6.83; 27 8.75,-5.56; 28 8.75,-4.29; 29 8.75,-3.02; 30 8.75,-1.75; 31 8.75,-0.48; 32 8.75,0.79; 33 8.75,2.06; 34 8.75,3.33; 35 8.75,4.6; 36 8.75,5.87; 37 8.75,7.14; 38 8.75,8.41 | smd 0.9 x 1.5: 15 -5.715,-9.35; 16 -4.445,-9.35; 17 -3.175,-9.35; 18 -1.905,-9.35; 19 -0.635,-9.35; 20 0.635,-9.35; 21 1.905,-9.35; 22 3.175,-9.35; 23 4.445,-9.35; 24 5.715,-9.35 | smd 0.9 x 0.9: 39 -1.5,1.07; 40 -2.9,1.07; 41 -0.1,1.07; 42 -2.9,-0.33; 43 -1.5,-0.33; 44 -0.1,-0.33; 45 -0.1,2.47; 46 -1.5,2.47; 47 -2.9,2.47
SOT230P700X180-4N = smd 1.75 x 0.95: 1 -3.15,2.3; 2 -3.15,0; 3 -3.15,-2.3 | smd 1.75 x 3.2: 4 3.15,0
DG1287502P1400AH = drill 1.4 pad 2.1: 1 0,0; 2 7.5,0
SRP7028A3R3M = smd 2.95 x 3.5: 1 -2.725,0; 2 2.725,0
SRU8043330Y = smd 2 x 3.2: 1 -3.9,0; 2 3.9,0
S02P = drill 1.016 long: 1 1.25,0; 2 -1.25,0
TO220BV = drill 1.016 long: D 0,-2.54; G -2.54,-2.54; S 2.54,-2.54
TO254P465X1024X2050-3P = drill 1.39 pad 2.085 square: 1 0,0 | drill 1.39 pad 2.085: 2 2.54,0; 3 5.08,0
SOT95P240X120-3N = smd 1 x 0.7: 1 -1.2,0.95; 2 -1.2,-0.95; 3 1.2,0
RESC3216X89N = smd 1.2 x 1.85: 1 -1.5,0; 2 1.5,0
R1206 = smd 1.6 x 1.803: 1 -1.422,0; 2 1.422,0
R0603 = smd 1 x 1.1: 1 -0.85,0; 2 0.85,0
0207/10 = drill 0.813 octagon: 1 -5.08,0; 2 5.08,0
3224W-1-105E = smd 2 x 1.3: 1 1.45,-1.25; 3 1.45,1.25 | smd 1.6 x 2: 2 -1.45,0
R2010 = smd 1.8 x 2.7: 1 -2.2,0; 2 2.2,0
S06P = drill 1.016 long: 1 6.25,0; 2 3.75,0; 3 1.25,0; 4 -1.25,0; 5 -3.75,0; 6 -6.25,0
TP10R = smd 1 x 1: TP 0,0

### Placement (x,y rotation side)
12VIN  2.54,88.9 90 top
BATTERY  3.81,63.5 270 top
C1  61.34,19.43 180 top
C2  67.82,19.43 180 top
C3  64.77,87.63 270 top
C6  3.81,76.2 180 top
C8  55.88,77.47 270 top
C9  25.78,76.2 90 top
C10  52.07,77.47 270 top
C11  66.8,72.64 0 top
C12  71.63,25.4 90 top
C13  66.93,75.56 0 top
C14  60.07,64.77 270 top
C15  25.78,87.5 270 top
C16  31.75,77.47 90 top
C17  45.85,13.08 0 top
C18  15.11,26.54 180 top
C19  19.43,28.83 0 top
C20  14.99,28.83 180 top
C21  62.99,61.34 270 top
C22  60.07,61.34 270 top
C23  60.96,52.07 270 top
C24  44.45,52.07 270 top
C25  68.71,55.12 180 top
C26  68.83,51.69 180 top
C27  29.21,77.47 270 top
C28  32.64,70.48 270 top
C29  34.04,60.45 180 top
C30  28.96,59.31 0 top
C31  20.45,52.96 270 top
C32  16.64,52.96 270 top
C33  12.83,52.96 270 top
C34  36.32,64.13 180 top
C35  53.34,90.68 90 top
C36  19.05,68.58 270 top
C37  28.96,62.48 0 top
C38  12.7,60.96 270 top
C39  63.5,35.56 270 top
D1  33.02,44.45 0 top
D2  74.93,38.1 270 top
D3  72.39,38.1 90 top
D5  53.34,49.53 180 top
D12  16.51,80.01 270 top
DISPLAY  46.99,3.81 0 top
ENCODER  22.86,3.81 0 top
HEADPHONE  8.89,12.7 90 top
IC1  66.04,23.88 270 top
IC2  25.65,67.31 180 top
IC3  60.45,72.01 0 top
IC4  33.02,21.59 0 top
IC7  53.34,55.88 180 top
J2  78.74,77.47 90 top
L1  40.01,70.74 0 top
L3  70.36,63.37 270 top
ON-OFF  52.07,69.72 270 top
Q1  1.27,46.99 90 top
Q2  16.51,88.9 90 top
Q3  44.45,82.55 0 top
Q4  33.02,88.9 90 top
Q9  14.99,37.21 0 top
Q11  52.07,10.79 0 top
R1  43.18,88.9 0 top
R2  67.82,16.38 0 top
R3  62.99,64.77 90 top
R4  57.15,64.77 270 top
R5  16.26,42.29 270 top
R6  19.3,17.53 0 top
R7  63.5,44.45 0 top
R8  66.04,30.48 270 top
R9  61.47,16.38 0 top
R10  66.04,35.56 90 top
R11  45.85,9.91 180 top
R12  45.72,19.18 0 top
R13  21.59,76.07 270 top
R15  11.43,81.28 90 top
R16  45.97,26.8 0 top
R17  45.85,15.75 0 top
R18  19.18,26.54 0 top
R19  8.89,42.29 90 top
R20  42.8,61.85 270 top
R21  34.92,77.47 270 top
R22  45.97,24.26 0 top
R23  15.24,74.93 90 top
R24  52.83,62.99 180 top
R26  17.78,74.93 270 top
R27  28.83,87.5 90 top
R28  26.67,81.28 90 top
R29  22.86,87.63 90 top
R30  12.57,42.29 270 top
R31  76.2,46.99 270 top
R32  38.1,77.47 270 top
R33  8.89,36.7 270 top
R34  38.1,60.33 0 top
R35  33.02,64.13 0 top
R36  16.51,64.77 90 top
R37  19.05,64.77 90 top
R38  19.05,60.96 270 top
R39  21.84,60.96 90 top
R40  16.51,60.96 90 top
R41  12.7,64.77 270 top
R42  12.7,68.58 270 top
R43  15.24,68.58 90 top
R46  58.42,30.48 90 top
R47  19.3,15.37 0 top
R48  80.01,46.99 90 top
R49  24.13,52.07 270 top
SERIAL  35.05,38.99 180 top
SPEAKER  8.89,26.67 90 top
TP1  48.9,13.59 0 top
TP2  64.01,46.99 0 top
TP3  34.29,50.8 0 top
TP4  31.75,53.34 0 top
TP5  57.15,90.17 0 top
TP6  12.7,91.44 0 top
TP7  21.59,33.02 0 top
TP8  74.3,18.29 0 top

### Tracks (layer width: path | path; a pad name or v marks a point on that pad's centre or on a via)
12V_IN
  Top 0.152: TP6.TP 12.7,89.79 11.81,88.9
  Top 0.508: 10.79,88.9 13.46,86.23 13.46,83.8 15.41,81.85 D12.1 | R15.2 11.43,86.74 9.35,88.82 | 11.81,88.9 14.35,86.36 14.35,84.07 16.13,82.3 20.32,82.3 23.37,79.25 23.37,76.71 22.86,76.2 19.94,76.2 18.67,77.47 15.75,77.47 15.24,76.96 R23.2
  Top 1.016: 9.35,88.82 12VIN.2
  Top 1.27: 12VIN.2 8.97,88.9 10.79,88.9 11.81,88.9 Q2.D
ACDRV  (via drill 0.35)
  Top 0.254: IC2.8 24.9,72 v24.38,72.52 | v25.15,79.38 26.04,79.38 26.67,80.01 R28.1
  Bottom 0.254: v24.38,72.52 24.38,78.61 v25.15,79.38
ACN  (via drill 0.3)
  Top 0.152: R21.2 C16.1 31.75,75.86 30.86,74.97 v30.86,73.28 | IC2.5 26.4,70.6 v26.92,71.12
  Bottom 0.152: v30.86,73.28 29.61,72.03 27.84,72.03 v26.92,71.12
ACP  (via drill 0.3)
  Top 0.152: v30.1,73.28 30.1,74.93 29.21,75.82 C27.2 30.14,76.62 30.48,76.96 30.48,77.98 30.82,78.32 C16.2 31.75,79.38 32.13,79.76 34.8,79.76 42.93,87.88 42.93,88.27 42.29,88.9 R1.1 | IC2.6 25.9,70.99 v26.04,71.12
  Top 1.2: 40.89,88.9 R1.1
  Top 1.27: Q4.D 40.89,88.9
  Bottom 0.152: v26.04,71.12 27.3,72.39 29.21,72.39 v30.1,73.28
ACSET
  Top 0.152: IC2.17 24.9,63.98 24.91,63.97 24.91,63.52 24.26,62.86 20.7,62.86 20.32,62.48 20.32,61.81
  Top 0.305: R38.1 20.32,61.81 R39.2
AVCC
  Top 0.305: IC2.4 26.9,70.21 27.94,71.25 27.94,73.66 26.8,74.8 C9.1 21.74,74.8 R13.2
BATDRV  (via drill 0.3)
  Top 0.152: IC2.19 25.9,62.49 v26.42,61.98 | R32.2 38.1,75.86 37.68,75.44 v37.08,75.44
  Bottom 0.152: v37.08,75.44 34.29,72.64 34.29,71.25 33.53,70.48 29.59,70.48 27.69,68.58 27.69,62.48 27.18,61.98 v26.42,61.98
BTST
  Top 0.152: 26.92,65.56 26.92,64.39 27.43,63.88 31.92,63.88 R35.1
  Top 0.2: IC2.21 26.92,65.56
CELL
  Top 0.152: IC2.14 23.4,64.53 22.76,63.88 20.83,63.88 20.07,63.12 19.05,63.12 17.02,63.12 16.51,62.61 R40.2
CMSRC  (via drill 0.4)
  Top 0.254: IC2.7 25.4,72.14 v25.65,72.39 | R27.1 28.83,85.6 v29.59,84.84
  Bottom 0.254: v25.65,72.39 25.65,78.61 29.59,82.55 v29.59,84.84
EN  (via drill 0.45)
  Top 0.305: IC4.3 24.24,27.43 21.72,27.43 21.21,26.92 21.21,26.04 20.7,25.53 18.67,25.53 18.33,25.87 R18.1 | C18.1 R18.1 | R18.1 18.33,24.85 18.92,24.26 20.95,24.26 v21.72,25.02 | v26.67,26.67 36.3,36.3 SERIAL.4
  Bottom 0.305: v21.72,25.02 23.37,26.67 v26.67,26.67
GND  (via drill 0.3, 0.35, 0.55)
  Top 0.152: C38.2 10.58,60.11 v10.16,59.69 | v11.43,49.53 12.32,49.53 12.7,49.91 12.7,51.88 C33.2 | v22.1,58.42 21.84,58.67 R39.1 | DISPLAY.8 39.37,3.93 39.37,6.35 41.27,8.25 45.09,8.25 45.85,9.02 45.85,12.23 | v21.21,64.9 20.23,63.92 R37.1
  Top 0.305: R3.1 62.78,63.92 62.1,63.25 62.1,61.38 C21.2 63.08,60.58 64.01,60.58 64.39,60.96 v64.39,61.21 | C22.2 60.07,59.44 v60.33,59.18 | C30.2 31.37,59.31 v31.75,59.69 | R26.1 18.84,75.78 19.56,75.06 v19.56,74.55 | C36.1 20.13,70.61 v20.83,70.61 | IC4.45 33.02,24.16 33.02,26.67 | v35.56,29.21 33.02,26.67 | IC4.38 39.85,30 v39.37,30.48 | 33.02,26.67 30.48,26.67 v29.21,27.94 | v26.67,29.21 26.16,29.21 25.37,30 IC4.1 | v29.21,64.77 28.32,64.77 | 28.32,64.77 27.9,65.19 IC2.23 | IC2.22 27.4,64.92 27.56,64.77 28.32,64.77 | C19.1 18.03,30.22 v18.67,30.86
  Top 0.508: C37.2 v31.62,62.48
  Bottom 0.152: v10.16,59.69 10.16,50.8 v11.43,49.53 | v22.1,58.42 22.61,58.42 22.73,58.55 22.73,63.75 21.59,64.9 v21.21,64.9
  Bottom 0.305: v60.33,59.18 60.96,59.18 62.99,61.21 v64.39,61.21 | v31.75,59.69 31.75,62.36 v31.62,62.48 | v19.56,74.55 19.56,73.15 20.83,71.88 v20.83,70.61 v20.83,66.67 20.83,65.28 v21.21,64.9 | v35.56,29.21 36.83,30.48 v39.37,30.48 | v29.21,27.94 27.94,29.21 v26.67,29.21 26.67,30.48 26.29,30.86 v18.67,30.86
  Bottom 0.508: v31.62,62.48 31.62,63.75 30.61,64.77 v29.21,64.77
  pour Top: 0,96.52 85.09,96.52 85.09,0 0,0
IO0
  Top 0.152: 43.85,14.35 43.85,13.46 44.23,13.08 | 44.23,13.08 C17.1 | R17.1 44.36,15.75 43.85,15.24 43.85,14.35 | IC4.25 42.7,13.49 43.56,14.35 43.85,14.35 | SERIAL.3 35.71,40.89 36.96,40.89 37.59,40.26 37.59,37.72 37.47,37.59 37.47,15.87 41.02,12.32 43.47,12.32 44.23,13.08 | TP1.TP 48.13,14.35 43.85,14.35
IO4  (via drill 0.3)  (1 unrouted)
  Top 0.152: IC4.26 42.95,14.76 43.47,15.28 43.47,18.42 44.23,19.18 R12.1 | v48.64,18.29 47.75,19.18 R12.2 | 71.12,22.86 71.25,22.86 72.39,21.72 v72.39,19.05 73.53,19.05 TP8.TP
  Top 0.406: IC1.6 70.74,23.24 71.12,22.86 71.12,16.89 70.61,16.38 R2.2
  Bottom 0.152: v48.64,18.29 49.15,17.78 71.12,17.78 v72.39,19.05
IO5  (via drill 0.3)
  Top 0.152: v39.37,16.51 39.37,17.65 40.29,18.57 IC4.29
  Bottom 0.152: DISPLAY.4 49.53,3.85 49.53,5.33 39.37,15.49 v39.37,16.51
IO18  (via drill 0.3)
  Top 0.152: v39.37,19.05 39.37,19.3 39.91,19.84 IC4.30
  Bottom 0.152: DISPLAY.3 51.44,4.37 51.44,5.97 39.37,18.03 v39.37,19.05
IO22  (via drill 0.3)
  Top 0.152: v38.1,24.89 38.1,25.15 40.41,27.46 IC4.36
  Bottom 0.152: DISPLAY.6 44.58,3.9 44.58,8.38 38.1,14.86 v38.1,24.89
IO23  (via drill 0.3)
  Top 0.152: v38.73,26.8 38.73,27.56 39.91,28.73 IC4.37
  Bottom 0.152: DISPLAY.5 46.99,6.86 38.73,15.11 v38.73,26.8
IO25
  Top 0.152: IC4.10 22.85,18.57 21.8,17.53 R6.2
IO26
  Top 0.152: IC4.11 22.89,17.3 20.95,15.37 R47.2
IO27  (via drill 0.3, 0.35)
  Top 0.152: IC4.12 23.27,16.03 21.21,13.97 v20.32,13.97 | v8.89,33.02 R33.2
  Bottom 0.152: v20.32,13.97 19.3,14.99 19.3,20.45 8.89,30.86 v8.89,33.02
IO33
  Top 0.152: IC4.9 27.28,19.84 31.5,15.62 37.08,15.62 42.8,9.91 R11.2
IO34  (via drill 0.3)
  Top 0.152: IC4.6 25.75,23.65 29.21,20.19 v29.21,19.05
  Bottom 0.152: ENCODER.3 22.86,6.86 23.75,7.75 25.15,7.75 27.56,10.16 27.56,17.4 v29.21,19.05
IO35  (via drill 0.3)  (1 unrouted)
  Top 0.152: IC2.9 24.38,69.05 24.38,70.36 23.11,71.63 14.99,71.63 v14.61,71.25 | R49.1 24.13,53.97 v23.5,54.61 | R49.2 v24.13,49.53 | IC4.7 22.07,22.38 v21.59,22.86
  Bottom 0.152: v14.61,71.25 14.61,59.05 19.05,54.61 v23.5,54.61 | v24.13,49.53 24.13,39.88 16.89,32.64 16.89,25.53 19.56,22.86 v21.59,22.86
ISET
  Top 0.152: R36.1 16.51,64.43 16.85,64.77 18.71,64.77 19.05,65.11 R37.2 21.17,65.62 22.11,66.56 IC2.13
N$1
  Top 0.406: D3.A 59.69,41.91 58.42,41.91 54.61,38.1 54.61,31.75 55.88,30.48 59.69,30.48 60.96,29.21 60.96,24.13 61.85,23.24 IC1.3
  Top 0.508: D3.A D2.C 76.2,43.18 R31.2
N$2
  Top 0.406: R19.2 8.15,44.45 Q1.G
N$3
  Top 0.406: R19.1 R30.2 R5.2 16.26,37.28 Q9.3
N$4
  Top 1.27: R7.1 D1.A
N$5
  Top 0.152: R33.1 13.75,38.12 Q9.1
N$6
  Top 1.27: D1.C 22.86,44.45 20.32,46.99 Q1.D
N$7
  Top 0.508: R48.2 R31.1 76.2,52.07
  Top 1.27: J2.1 78.87,77.34 78.87,54.74 76.2,52.07 R7.2
N$8
  Top 0.152: R6.1 17.53,17.53 17.14,17.14 17.14,15.62 15.98,14.46 9.4,14.46 HEADPHONE.2
N$9
  Top 0.406: IC1.1 64.77,25.78 65.15,26.16 65.15,28.67 R8.1
N$10
  Top 0.406: R10.1 R8.2
N$11
  Top 0.406: IC1.8 67.31,25.78 67.06,26.04 | 67.06,26.04 67.06,25.27 65.91,24.13 65.91,19.85 66.33,19.43 C2.2 | 67.06,26.04 67.06,28.8 R8.3
N$12
  Top 0.406: R2.1 66.27,16.51 65.02,16.51 64.52,17.02 | 64.52,19.05 65.3,19.84 65.3,24.11 64.9,24.51 IC1.2 | 64.52,17.02 64.52,19.05 | 64.52,17.02 63.88,16.38 R9.2 | C1.1 64.14,19.43 64.52,19.05
N$13
  Top 0.406: C2.1 69.81,19.43 70.1,19.72 70.1,21.72 69.85,21.97 IC1.5
N$14
  Top 0.508: R13.1 21.59,79.12 20.7,80.01 D12.3
N$15
  Top 0.152: Q11.2 48.65,7.62 43.18,7.62 41.91,6.35 41.91,3.89 DISPLAY.7
N$16
  Top 0.508: R15.1 11.43,77.47 10.16,76.2 C6.1
N$17
  Top 0.406: IC3.1 56.13,73.91 54.1,71.88 54.1,64.81 53.68,64.39 R24.1
N$18
  Top 0.406: IC3.7 C11.1
N$19
  Top 0.406: C11.2 69.6,72.64 70.36,71.88 70.36,70.74
  Top 0.508: IC3.6 69.72,71.37 70.36,70.74 L3.1
N$21
  Top 0.305: R27.2 28.83,89.79 30.48,91.44
  Top 0.508: R29.2 22.86,90.17 24.13,91.44 | C15.1 25.78,89.92 27.3,91.44
  Top 1.27: Q2.S 24.13,91.44 27.3,91.44 30.48,91.44 Q4.S
N$22
  Top 0.508: Q2.G 19.05,85.09 20.32,83.82 24.13,83.82 | Q4.G 35.56,85.09 34.29,83.82 27.18,83.82 | 25.78,83.82 27.18,83.82 | 25.78,83.82 24.13,83.82 | R29.1 22.86,85.09 24.13,83.82 | C15.2 25.78,85.22 27.18,83.82 | 25.78,83.82 26.67,82.93 R28.2
N$23
  Top 0.152: Q3.1 41.27,82.55 38.06,79.34 38.06,78.36 R32.1
N$24
  Top 0.406: R3.2 C14.1 R4.1 55.54,65.62 54.74,66.42 54.74,71.12 56.26,72.64 IC3.2
N$25
  Top 0.152: R35.2 C34.2
N$27
  Top 0.152: R41.2 C38.1
N$29
  Top 0.152: SPEAKER.2 8.87,25.4 7.62,25.4 6.35,24.13 6.35,10.16 7.62,8.89 8.83,8.89 HEADPHONE.4
N$30
  Top 0.406: IC3.3 56.39,71.37 55.35,70.33 55.35,67.44 55.98,66.8 63.63,66.8 64.39,66.04 64.39,62.74 63.84,62.19 C21.1
N$31
  Top 0.152: R11.1 46.95,10.16 48.26,10.16 49.84,11.74 Q11.1
N$32
  Top 0.152: R47.1 17.4,15.37 16.02,13.99 11.18,13.99 8.89,11.7 HEADPHONE.3
N$33
  Top 0.406: C22.1 61,62.19 61.47,61.72 61.47,59.94 61.98,59.44 64.14,59.44 65.15,60.45 65.15,66.14 63.86,67.44 56.26,67.44 55.96,67.74 55.96,69.55 56.52,70.1 IC3.4
N$35
  Top 0.305: Q11.3 53.27,18.98 58.42,24.13 R46.1
ON-OFF
  Top 0.508: R24.2 51.18,62.99 50.67,63.5 50.67,67.94 51.2,68.47 ON-OFF.1
OVPSET  (via drill 0.3)
  Top 0.152: IC2.18 25.32,65.51 25.32,63.43 22.93,61.03 20.5,61.03 v20.45,61.09
  Top 0.305: v16.51,72.77 16.51,72.81
  Top 0.508: R23.1 15.24,73.19 15.62,72.81 16.51,72.81 17.4,72.81 17.78,73.19 R26.2
  Bottom 0.152: v20.45,61.09 18.16,61.09 15.75,63.5 15.75,70.87 16.51,71.63 v16.51,72.77
REGN
  Top 0.152: IC2.20 26.4,62.88 26.8,62.48 C37.1
RXD
  Top 0.152: R16.2 46.82,29.25 40.16,35.91 40.16,38.48 40.67,38.99 SERIAL.6
RXD0
  Top 0.152: IC4.34 43.53,24.92 44.2,24.26 R22.1
SENSOR_VN  (via drill 0.3)
  Top 0.152: IC4.5 25.88,24.92 v27.94,22.86
  Bottom 0.152: ENCODER.4 20.32,3.85 20.32,7.11 21.34,8.13 25.02,8.13 27.05,10.16 27.05,17.78 27.94,18.67 v27.94,22.86
SENSOR_VP  (via drill 0.3)
  Top 0.152: IC4.4 25.88,26.19 v26.67,25.4
  Bottom 0.152: ENCODER.5 17.86,6.68 19.68,8.51 24.81,8.51 26.67,10.37 26.67,18.03 27.56,18.92 27.56,22.48 26.67,23.37 v26.67,25.4
SRN  (via drill 0.3)
  Top 0.152: IC2.15 23.9,64.04 v23.37,63.5 | v23.62,58.8 26.67,58.8 27.3,58.17 33.91,58.17 34.91,59.16 34.91,60.43 | R34.1 35.01,60.33 34.91,60.43 | 34.91,60.43 C29.1
  Bottom 0.152: v23.37,63.5 23.37,59.05 v23.62,58.8
SRP  (via drill 0.3)
  Top 0.152: IC2.16 24.4,63.77 v24.38,63.75 | v24,59.94 24,59.69 24.51,59.18 27.98,59.18 C30.1 28.11,60.11 28.45,60.45 C29.2 33.19,61.38 33.78,61.98 42.42,61.98 42.8,62.36 R20.1
  Top 0.508: L1.2 42.73,63.42 R20.1
  Bottom 0.152: v24.38,63.75 24.38,63.5 23.73,62.84 23.73,60.22 v24,59.94
SW
  Top 0.152: C34.1 37.17,70.63 L1.1
  Top 0.508: IC2.1 30.11,68.06 30.48,67.69 30.48,67.31 | IC2.24 30.11,66.56 30.48,66.93 30.48,67.31 | 30.48,67.31 34.16,67.31 34.92,68.07 34.92,70.16 35.5,70.74 L1.1
TS  (via drill 0.3)
  Top 0.152: IC2.10 23.9,70.08 22.73,71.25 16.26,71.25 15.24,70.23 R43.2 15.24,70.19 14.99,70.45 13.97,70.45 | 13.97,70.45 13.08,70.45 12.7,70.06 R42.1 | v13.34,71.25 13.97,70.61 13.97,70.45
  Bottom 0.152: v13.34,71.25 10.67,71.25 5.41,65.99 BATTERY.2
TTC
  Top 0.152: IC2.11 23.37,69.07 23.37,69.98 22.99,70.36 21.72,70.36 19.94,68.58 11.56,68.58 11.3,68.33 11.3,66.93 11.56,66.67 12.45,66.67 12.7,66.42 R41.1
TXD
  Top 0.152: R22.2 46.82,25.31 45.97,26.16 45.97,29.21 38.73,36.45 38.73,38.92 SERIAL.5
TXD0
  Top 0.152: IC4.35 43.46,26.19 44.07,26.8 R16.1
VBATT
  Top 0.152: R34.2 39.88,60.33 41.15,61.59 42.55,61.59 42.8,61.34 R20.2 | 30.48,56.01 31.75,54.74 TP4.TP
  Top 0.508: D12.2 14.42,79.06 13.59,78.23 13.59,77.09 8.89,72.39 8.89,59.79 5.11,56.01 | R20.2 42.8,56.39 43.18,56.01
  Top 1.016: C33.1 12.7,54.04 12.7,56.01 | C32.1 16.51,54.49 16.51,56.01 | C31.1 20.32,54.49 20.32,56.01
  Top 1.27: Q3.2 46.99,58.67 44.32,56.01 43.18,56.01 30.48,56.01 20.32,56.01 16.51,56.01 12.7,56.01 5.11,56.01 3.83,56.01
  Top 1.78: 3.83,56.01 BATTERY.4
VCC  (via drill 0.45, 0.55)  (2 unrouted)
  Top 0.152: R21.1 34.92,79.38 43.31,87.76 43.31,88.27 43.94,88.9 R1.2 | TP2.TP v66.04,46.99 | TP5.TP 57.15,88.9 55.88,87.63
  Top 0.2: 18.95,67.73 C36.2
  Top 0.254: 27.94,70.48 27.4,69.95 IC2.3
  Top 0.305: IC2.12 21.07,68.06 20.32,67.31 19.37,67.31 C36.2 18.73,67.31 17.14,67.31 16.51,66.67 | 16.51,66.67 R36.2 14.82,65.62 14.39,65.19 14.39,59.94 15.28,59.05 16.26,59.05 | R43.1 15.24,67.06 15.62,66.67 16.51,66.67 | 16.26,59.05 18.8,59.05 19.05,59.31 R38.2 | R40.1 16.51,59.31 16.26,59.05 | IC2.2 27.9,70.45 27.94,70.48 29.21,70.48 30.61,71.88 C28.1 32.64,73.66 | 46.99,88.9 46.99,88.65 45.72,87.38 44.32,87.38 36.58,79.63 36.58,76.07 35.43,74.93 33.91,74.93 32.64,73.66 | R46.2 58.42,34.29 64.26,40.13 v65.53,40.13 | 32.64,73.66
  Top 0.406: 52.07,78.74 C10.1 | C14.2 R4.2 57.15,61.09 64.9,53.34 70.11,53.34 | 70.36,55.37 C25.1 | C23.+ 60.63,50.8 | IC7.3 58.15,58.18 58.87,57.46 58.87,51.11 59.51,50.47 | C23.+ 62.18,50.47 63.25,49.4 70.11,49.4 | 59.51,50.47 59.44,50.47 58.5,49.53 D5.1 | 59.51,50.47 C23.+ | R10.2 66.04,37.21 | R5.1 16.26,44.6 16.74,45.09 19.18,45.09 22.73,41.53 v49.28,41.53 | v65.53,40.13 66.04,39.62 66.04,37.34 64.05,37.34 63.5,36.79 C39.1
  Top 0.508: Q3.3 49.53,80.01 50.8,78.74 52.07,78.74 | C10.1 C8.1 | C8.1 55.88,77.98 55.37,77.47 50.55,77.47 49.91,76.83 49.91,74.17 52.07,72.01 ON-OFF.2 | L3.2 70.36,55.37 | C25.1 70.11,53.34 70.11,51.82 C26.1 70.23,49.28 | v66.04,46.99 68.33,46.99 70.23,48.89 70.23,49.28 | 50.1,86.93 51.94,85.09 64.77,85.09 68.58,81.28 78.74,81.28 82.55,77.47 82.55,31.11 75.95,24.51 71.67,24.51 C12.1 71.59,24.51 IC1.7 | R10.2 66.04,37.34 | 70.23,49.28 70.11,49.4 | IC3.8 65.28,73.91 66.08,74.72 C13.1 66.08,77.43 64.77,78.74 56.01,78.74 C8.1
  Top 1.2: R1.2 45.72,88.9
  Top 1.27: 49.53,86.36 Q3.3 | 49.53,86.36 48.26,87.63 | 48.26,87.63 46.99,88.9 45.72,88.9 | 50.1,86.93 49.53,86.36 | 53.34,87.63 55.88,87.63 C3.1 76.08,87.63 J2.2 | 53.34,87.63 48.26,87.63 | C35.1 53.34,87.63
  Bottom 0.152: ENCODER.2 25.4,3.85
  Bottom 0.305: 25.4,3.85 25.4,5.08 30.48,10.16 30.48,29.59 35.18,34.29 43.05,34.29 49.28,40.51 v49.28,41.53 | ENCODER.2 25.36,3.18 26.63,1.9 35.85,1.9 36.99,3.05 DISPLAY.9
  Bottom 0.406: v65.53,40.13 63.75,41.91 63.75,42.67 | 63.75,42.67 63.75,43.43 66.04,45.72 v66.04,46.99 | 63.75,42.67 50.42,42.67 v49.28,41.53
VCCIO  (via drill 0.45)
  Top 0.152: TP3.TP 34.29,49.53 v35.56,48.26 | TP7.TP 22.23,32.38 22.23,31.75
  Top 0.305: 49.66,15.75 R17.2 | 49.66,15.75 50.16,16.26 50.16,28.57 43.69,35.05 v42.55,35.05 | 49.66,15.75 49.66,14.86 52.07,12.45 52.07,10.16 54.49,7.74 DISPLAY.2 | IC4.2 24.17,28.83 C19.2 | C19.2 20.83,28.07 20.03,27.27 R18.2 | C20.2 13.97,29 13.97,30.48 15.24,31.75 21.97,31.75 | SERIAL.2 31.3,38.16 30.1,36.96 27.43,36.96 22.23,31.75 21.97,31.75 | C19.2 20.83,30.61 21.97,31.75
  Top 0.406: IC7.4 50.19,52.73 47.93,50.47 | 47.93,50.47 C24.+ 37.77,50.47 v35.56,48.26 | 47.93,50.47 48.87,49.53 D5.2
  Top 0.508: IC7.4 IC7.2
  Bottom 0.305: v42.55,35.05 35.24,35.05 SERIAL.2
  Bottom 0.406: v35.56,48.26 35.56,46.99 31.3,42.73 SERIAL.2
(copper drawn outside any net)
  shapes: Top area x2